# EAGLE design correli V1 (EAGLE 9.3.2)
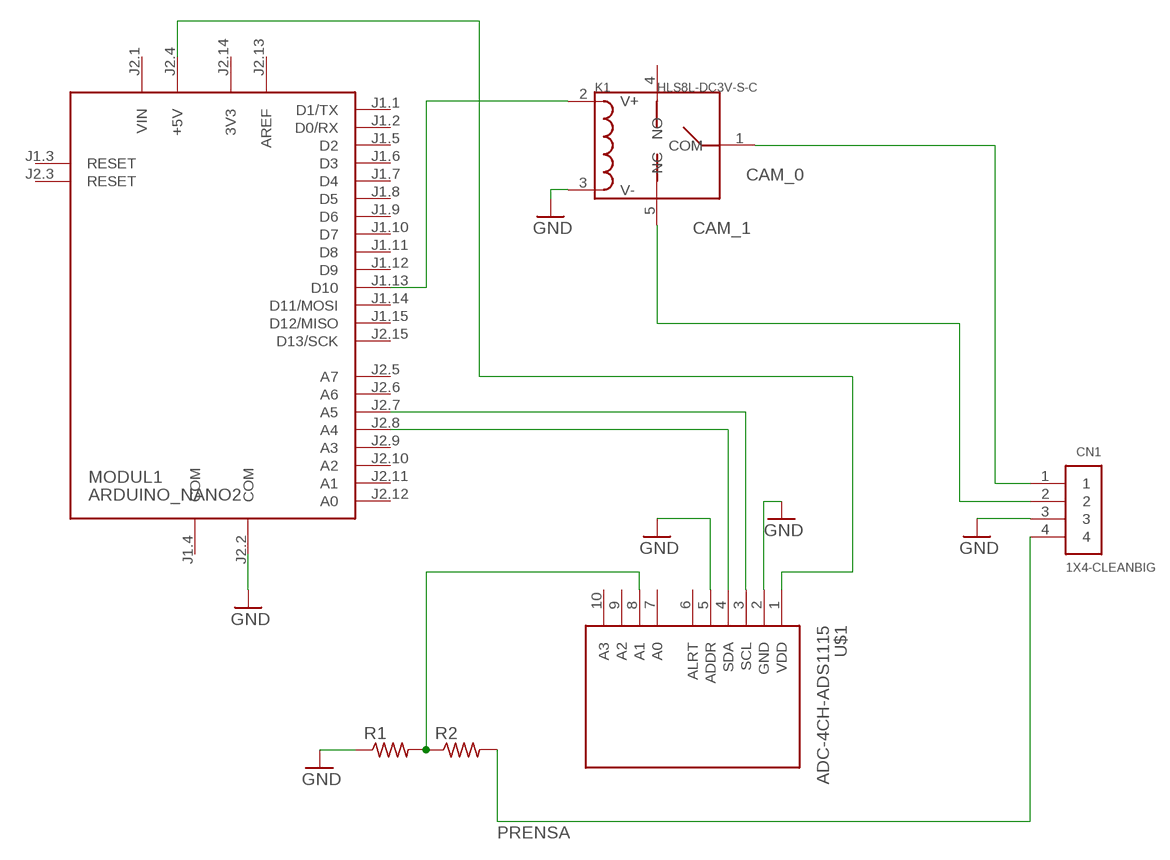
[diagram p0: schematic, sheet 1]

## Parts
CN1  1X4-CLEANBIG  [1X04-CLEANBIG]
K1  HLS8L-DC3V-S-C  RELAY-HLS8L-DC3V-S-C(5P-19X15MM)  [REY5-19.0X15.0X15.0MM]
MODUL1  ARDUINO_NANO2  [ARDUINO_NANO2]
R1  R-US_0309/12  [0309/12]
R2  R-US_0309/12  [0309/12]
U$1  ADC-4CH-ADS1115  [ADC-4CH-ADS1115]

## Nets
CAM_0: CN1.1 K1.1(COM)
CAM_1: CN1.2 K1.5(NC)
GND: CN1.3 K1.3(V-) MODUL1.J2.2(COM) R1.1 U$1.2(GND) U$1.5(ADDR)
N$1: K1.2(V+) MODUL1.J1.13(D10)
N$3: MODUL1.J2.4(+5V) U$1.1(VDD)
N$4: MODUL1.J2.7(A5) U$1.3(SCL)
N$5: MODUL1.J2.8(A4) U$1.4(SDA)
N$6: R1.2 R2.1 U$1.8(A1)
PRENSA: CN1.4 R2.2
Unconnected: K1.4(NO) MODUL1.J1.1(D1/TX) MODUL1.J1.2(D0/RX) MODUL1.J1.3(RESET) MODUL1.J1.5(D2) MODUL1.J1.6(D3) MODUL1.J1.7(D4) MODUL1.J1.8(D5) MODUL1.J1.9(D6) MODUL1.J1.10(D7) MODUL1.J1.11(D8) MODUL1.J1.12(D9) MODUL1.J1.14(D11/MOSI) MODUL1.J1.15(D12/MISO) MODUL1.J2.3(RESET) MODUL1.J2.5(A7) MODUL1.J2.6(A6) MODUL1.J2.9(A3) MODUL1.J2.10(A2) MODUL1.J2.11(A1) MODUL1.J2.12(A0) MODUL1.J2.15(D13/SCK) U$1.6(ALRT) U$1.7(A0) U$1.9(A2) U$1.10(A3)

## Power pins joined to a net without a drawn wire
3V3: MODUL1.J2.14(3V3)
AREF: MODUL1.J2.13(AREF)
COM: MODUL1.J1.4(COM)
VIN: MODUL1.J2.1(VIN)

## Library data of the parts
CN1 = adafruit:1X4: 4-pin connector
K1 = nosso_relay:RELAY-HLS8L-DC3V-S-C(5P-19X15MM): 315030009; MPN: HLS8L-DC3V-S-C
MODUL1 = arduino2:ARDUINO_NANO2: Arduino Nano2 Auto generated by modulcreator.ulp \;; ANZAHL: 2; MODUL: TRUE; STECKX0: -76200; STECKX1: 76200; STECKY0: 177800; STECKY1: 177800
R1 R2 = adafruit:R-US_: RESISTOR, American symbol
U$1 = diy-modules:ADC-4CH-ADS1115: 4 Channel 16-Bit Analog-to-Digital Converter based on ADS1115 chip Arduino ADS1115 Getting Started Tutorial is available here: http://henrysbench.capnfatz.com/henrys-bench/arduino-voltage-measurements/arduino-ads1115-module-getting-started-tutorial/ ADS1115 datasheet is available here: http://www.ti.com/lit/ds/symlink/ads1115.pdf Click here to find device on ebay.com <http://www.ebay.com/sch/ads1115+module>

## Board
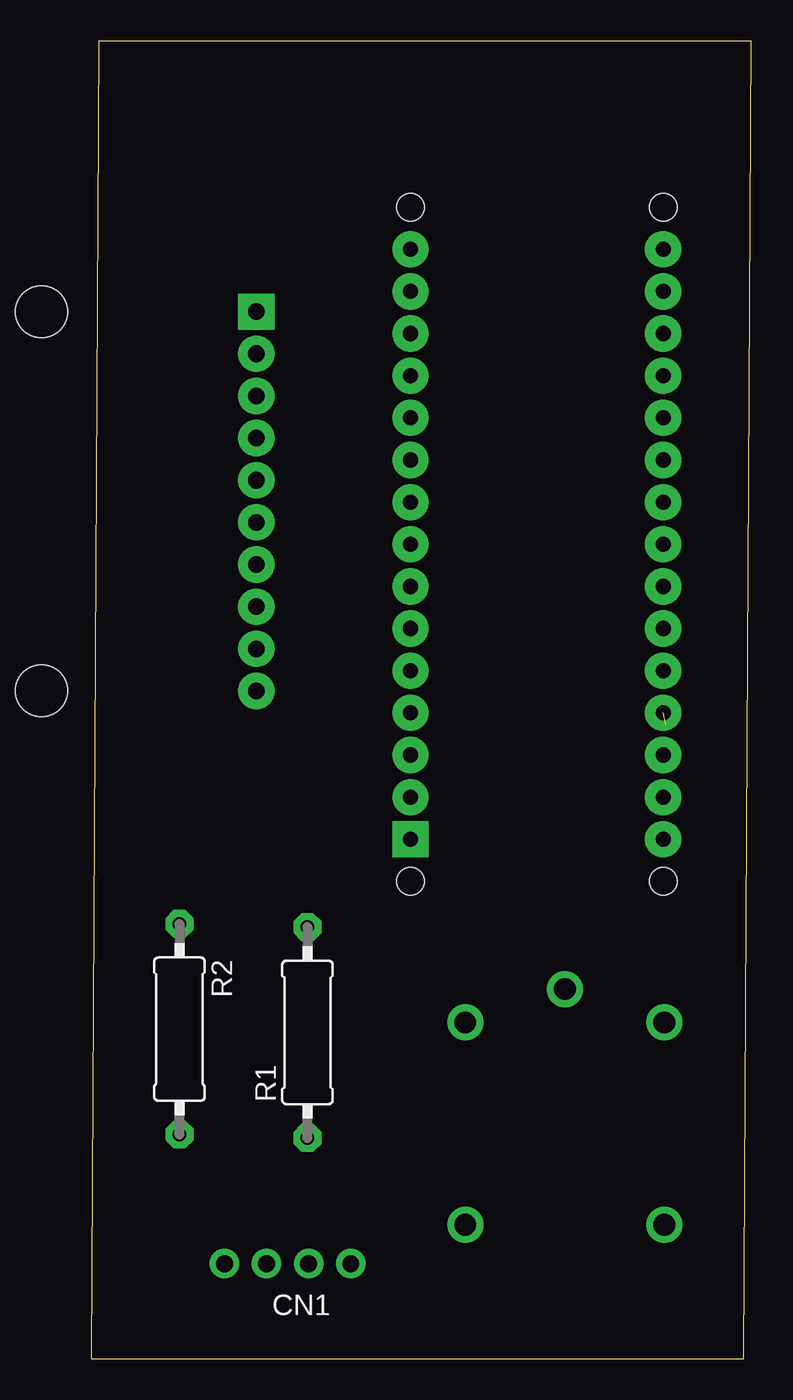
[diagram p1: board, top side]
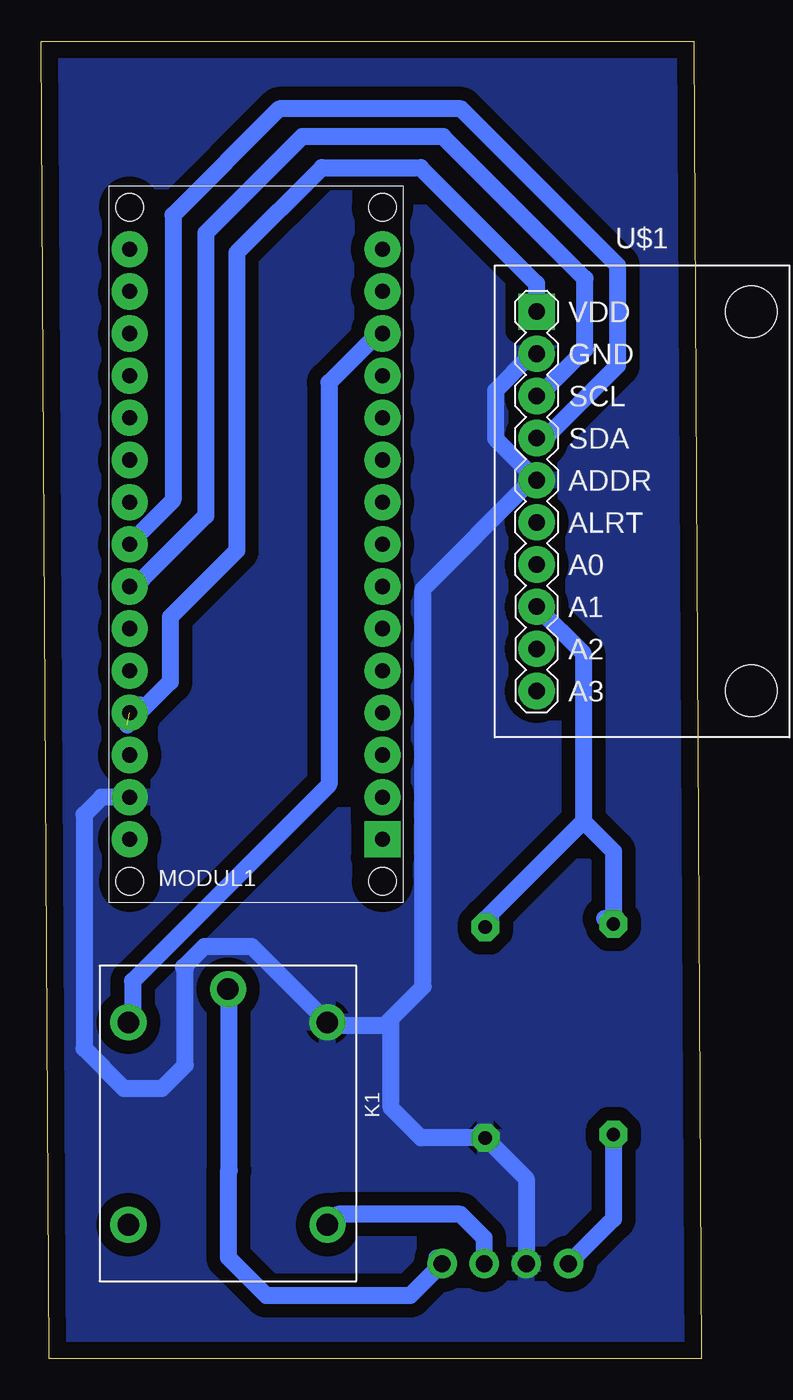
[diagram p2: board, bottom side, seen from below]

Size 39.8 x 79.38 mm. Coordinates in mm from the lower left corner, seen from the top.
Outline: 0,0 39.35,0 39.8,79.38 0.45,79.38 0,0
Copper layers (1*16): Top 0.035mm / dielectric 1.5mm / Bottom 0.035mm
Design rules "default *": minimum track width 40mil, minimum drill 0.35mm, track to track 6mil, track to pad 6mil, pad to pad 6mil, via to via 6mil, smd to smd 6mil, copper to edge 40mil, drill to drill 20mil, minimum pad ring 10mil, minimum via ring 8mil, stop-mask expansion 4mil, vias tented up to drill 0mil, thermal gap 10mil

### Footprints (pad centres in the part's own frame; a part is rotated, then mirrored left to right if it is on the bottom)
1X04-CLEANBIG = drill 1.016 pad 1.778: 1 -3.81,0; 2 -1.27,0; 3 1.27,0; 4 3.81,0
REY5-19.0X15.0X15.0MM = drill 1.3 pad 2.184: 1 -8.1,0; 2 -6.1,-6; 3 -6.1,6; 4 6.1,-6; 5 6.1,6
ARDUINO_NANO2 = drill 0.914 pad 2.184 square: J1.1 -7.62,17.78 | drill 0.914 pad 2.184: J1.2 -7.62,15.24; J1.3 -7.62,12.7; J1.4 -7.62,10.16; J1.5 -7.62,7.62; J1.6 -7.62,5.08; J1.7 -7.62,2.54; J1.8 -7.62,0; J1.9 -7.62,-2.54; J1.10 -7.62,-5.08; J1.11 -7.62,-7.62; J1.12 -7.62,-10.16; J1.13 -7.62,-12.7; J1.14 -7.62,-15.24; J1.15 -7.62,-17.78; J2.1 7.62,17.78; J2.2 7.62,15.24; J2.3 7.62,12.7; J2.4 7.62,10.16; J2.5 7.62,7.62; J2.6 7.62,5.08; J2.7 7.62,2.54; J2.8 7.62,0; J2.9 7.62,-2.54; J2.10 7.62,-5.08; J2.11 7.62,-7.62; J2.12 7.62,-10.16; J2.13 7.62,-12.7; J2.14 7.62,-15.24; J2.15 7.62,-17.78 | hole 1.651: -7.62,-20.32; 7.62,-20.32; 7.62,20.32; -7.62,20.32
0309/12 = drill 0.813 pad 1.676 octagon: 1 -6.35,0; 2 6.35,0
ADC-4CH-ADS1115 = drill 1 pad 2.184 square: 1 -6.35,11.43 | drill 1 pad 2.184: 2 -6.35,8.89; 3 -6.35,6.35; 4 -6.35,3.81; 5 -6.35,1.27; 6 -6.35,-1.27; 7 -6.35,-3.81; 8 -6.35,-6.35; 9 -6.35,-8.89; 10 -6.35,-11.43 | hole 3.1: 6.604,11.43; 6.604,-11.43

### Placement (x,y rotation side)
CN1  11.83,5.71 180 top
K1  28.55,14.16 270 bottom
MODUL1  26.86,49.07 180 bottom
R1  13.03,19.65 90 top
R2  5.31,19.85 270 top
U$1  3.59,51.66 0 bottom

### Tracks (layer width: path | path; a pad name or v marks a point on that pad's centre or on a via)
CAM_0
  Bottom 1.016: 15.96,6.06 CN1.1 17.57,3.78 26.23,3.78 28.53,6.08 28.53,11.26 28.47,11.32 28.47,21.84 K1.1
CAM_1
  Bottom 1.016: 22.05,8.4 K1.5 21.93,8.68 14.53,8.68 13.1,7.26 CN1.2
GND
  Bottom 1.016: U$1.2 10.36,60.39 12.41,58.34 12.41,55.44 10.36,53.38 U$1.5 10.36,52.8 16.79,46.37 16.79,22.42 18.72,20.49 | 12.7,13.07 R1.1 | K1.3 22.05,20.08 19.12,20.08 18.72,20.49 | 13.28,13.66 R1.1 | 34.9,33.52 MODUL1.J2.2 36.18,33.83 37.24,32.78 37.24,18.69 34.83,16.28 32.53,16.28 31.13,17.68 31.13,23.48 31.23,23.58 29.98,24.84 27.13,24.84 K1.3 | 22.63,20.67 K1.3 | R1.1 10.56,10.83 CN1.3 | R1.1 16.91,13.3 18.72,15.11 18.72,20.49
  pour Bottom (isolate 0.813): -0.27,-2.42 40.03,-2.42 40.03,81.18 -0.27,81.18
N$1
  Bottom 1.016: K1.2 34.31,20.67 34.31,22.74 22.46,34.59 22.46,58.81 19.71,61.56 MODUL1.J1.13
N$3  (1 unrouted)
  Bottom 1.016: 33.73,39.36 34.31,39.36 MODUL1.J2.4 | 34.63,38.18 32.03,40.78 32.03,44.68 28.03,48.68 28.03,66.64 22.89,71.78 16.94,71.78 9.94,64.78 U$1.1
N$4
  Bottom 1.016: MODUL1.J2.7 34.31,46.96 33.73,46.96 29.9,50.79 29.9,67.83 24.08,73.65 15.59,73.65 7.03,65.08 7.03,60.81 9.78,58.06 U$1.3
N$5
  Bottom 1.016: MODUL1.J2.8 34.31,49.29 31.87,51.74 31.87,68.91 25.46,75.31 14.5,75.31 5.06,65.87 5.06,59.86 9.78,55.14 U$1.4
N$6
  Bottom 1.016: 5.84,26.51 R2.1 | 12.7,26.51 R1.2 13.03,26.48 7.13,32.38 | 10.36,45.2 U$1.8 7.13,42.5 7.13,32.38 | R2.1 5.55,26.2 | 7.13,32.38 5.31,30.57 R2.1
PRENSA
  Bottom 1.016: R2.2 5.31,8.42 CN1.4